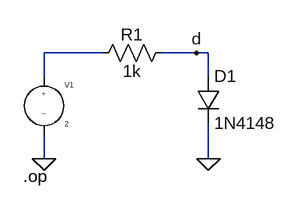
[diagram p0: schematic diode.asc]
diode.asc, the LTspice schematic file:
Version 4
SHEET 1 880 680
WIRE 208 96 128 96
WIRE 336 96 288 96
WIRE 352 96 336 96
WIRE 128 128 128 96
WIRE 352 128 352 96
WIRE 128 240 128 208
WIRE 352 240 352 192
FLAG 128 240 0
FLAG 352 240 0
FLAG 336 96 d
SYMBOL source-V 128 112 R0
SYMATTR InstName V1
SYMATTR Value 2
SYMBOL res 192 112 R270
WINDOW 0 25 56 VTop 2
WINDOW 3 7 56 VBottom 2
SYMATTR InstName R1
SYMATTR Value 1k
SYMBOL diode 336 128 R0
SYMATTR InstName D1
SYMATTR Value 1N4148
TEXT 100 264 Left 2 !.op

The netlist it stands for:
* diode.asc
V1 N001 0 2
R1 N001 d 1k
D1 d 0 1N4148
.model D D
.lib standard.dio
.op
.backanno
.end